# Altium project AHRS_Bord.PrjPCB
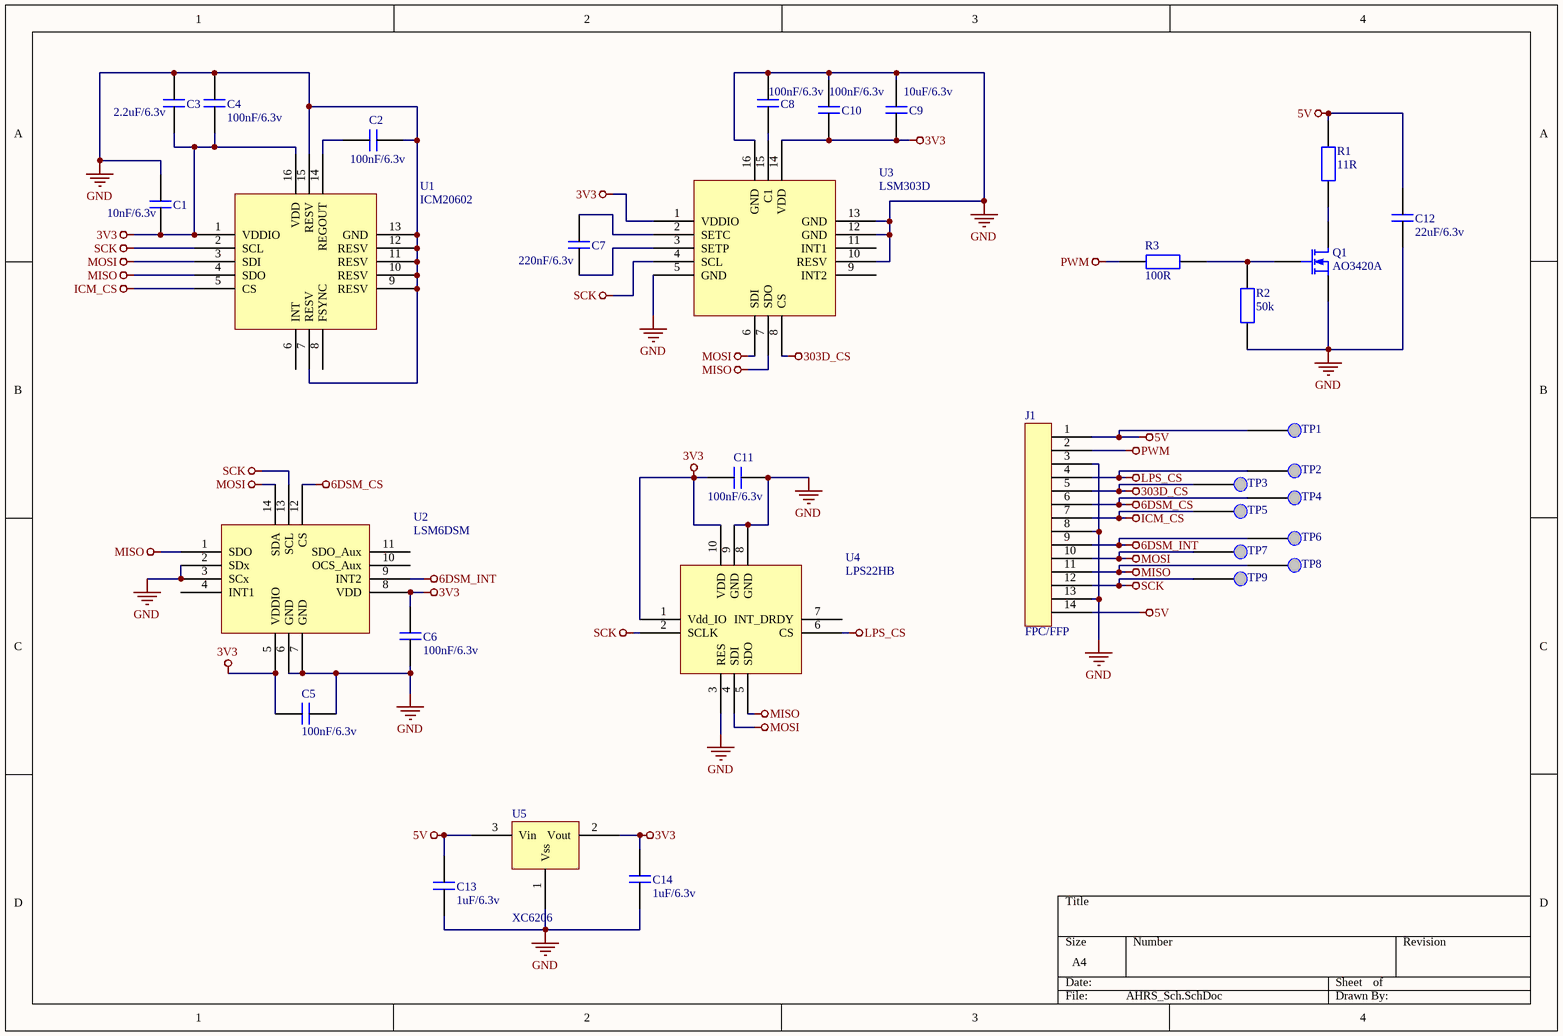
[diagram p0: AHRS_Sch.SchDoc]
1 sheet, 33 parts. Net scope: global (net labels, ports and power ports of the same name join across sheets).
Board file: AHRS_PCB.PcbDoc

## Sheet AHRS_Sch.SchDoc
size A4

### Parts
C1  10nF/6.3v  [C_0603]
C2  100nF/6.3v  [C_0603]
C3  2.2uF/6.3v  [C_0603]
C4  100nF/6.3v  [C_0603]
C5  100nF/6.3v  [C_0603]
C6  100nF/6.3v  [C_0603]
C7  220nF/6.3v  [C_0603]
C8  100nF/6.3v  [C_0603]
C9  10uF/6.3v  [C_0603]
C10  100nF/6.3v  [C_0603]
C11  100nF/6.3v  [C_0603]
C12  22uF/6.3v  [C_0805]
C13  1uF/6.3v  [C_0603]
C14  1uF/6.3v  [C_0603]
J1  FPC/FFP  [FPC/FFP]
Q1  AO3420A  [SOT-23]
R1  11R  [R_2512]
R2  50k  [R_0603]
R3  100R  [R_0603]
TP1  (no value)  [Test_Point]
TP2  (no value)  [Test_Point]
TP3  (no value)  [Test_Point]
TP4  (no value)  [Test_Point]
TP5  (no value)  [Test_Point]
TP6  (no value)  [Test_Point]
TP7  (no value)  [Test_Point]
TP8  (no value)  [Test_Point]
TP9  (no value)  [Test_Point]
U1  ICM20602  [LGA-16]
U2  LSM6DSM  [LGA-14L]
U3  LSM303D  [LGA-16]
U4  LPS22HB  [HLGA-10L]
U5  XC6206  [SOT-23]

### Nets
3V3: C1.2 C3.2 C4.1 C5.2 C6.2 C9.1 C10.1 C11.2 C14.2 U1.1(VDDIO) U1.16(VDD) U2.5(VDDIO) U2.8(VDD) U3.1(VDDIO) U3.14(VDD) U4.1(Vdd_IO) U4.10(VDD) U5.2(Vout)
5V: C12.2 C13.2 J1.1 J1.14 R1.1 TP1.1 U5.3(Vin)
6DSM_CS: J1.6 TP4.1 U2.12(CS)
6DSM_INT: J1.9 TP6.1 U2.9(INT2)
303D_CS: J1.5 TP3.1 U3.8(CS)
GND: C1.1 C2.1 C3.1 C4.2 C5.1 C6.1 C8.1 C9.2 C10.2 C11.1 C12.1 C13.1 C14.1 J1.3 J1.8 J1.13 Q1.3(S) R2.1 U1.7(RESV) U1.9(RESV) U1.10(RESV) U1.11(RESV) U1.12(RESV) U1.13(GND) U1.15(RESV) U2.2(SDx) U2.3(SCx) U2.6(GND) U2.7(GND) U3.5(GND) U3.10(RESV) U3.12(GND) U3.13(GND) U3.16(GND) U4.3(RES) U4.8(GND) U4.9(GND) U5.1(Vss)
ICM_CS: J1.7 TP5.1 U1.5(CS)
LPS_CS: J1.4 TP2.1 U4.6(CS)
MISO: J1.11 TP8.1 U1.4(SDO) U2.1(SDO) U3.7(SDO) U4.5(SDO)
MOSI: J1.10 TP7.1 U1.3(SDI) U2.14(SDA) U3.6(SDI) U4.4(SDI)
PWM: J1.2 R3.1
SCK: J1.12 TP9.1 U1.2(SCL) U2.13(SCL) U3.4(SCL) U4.2(SCLK)
NetC2_2: C2.2 U1.14(REGOUT)
NetC7_1: C7.1 U3.2(SETC)
NetC7_2: C7.2 U3.3(SETP)
NetC8_2: C8.2 U3.15(C1)
NetQ1_1: Q1.1(G) R2.2 R3.2
NetQ1_2: Q1.2(D) R1.2

Not connected (* = marked no-connect by the designer): U1 6(INT) 8(FSYNC); U2 4(INT1) 10(OCS_Aux) 11(SDO_Aux); U3 9(INT2) 11(INT1); U4 7(INT_DRDY)

### Library data of the parts
C1-C14 = Capacitence
J1 = FPC/FFP: Connector
Q1 = AO3420A: MOSFET
R1-R3 = Resistence
TP1-TP9 = Testpoint
U1 = ICM20602: IMU
U2 = LSM6DSM: IMU
U3 = LSM303D: Accelerometer & Compass
U4 = LPS22HB: Barometer
U5 = XC6206P332: LDO